# EAGLE schematic dsub37_to_rj45 (EAGLE 7.5.0)
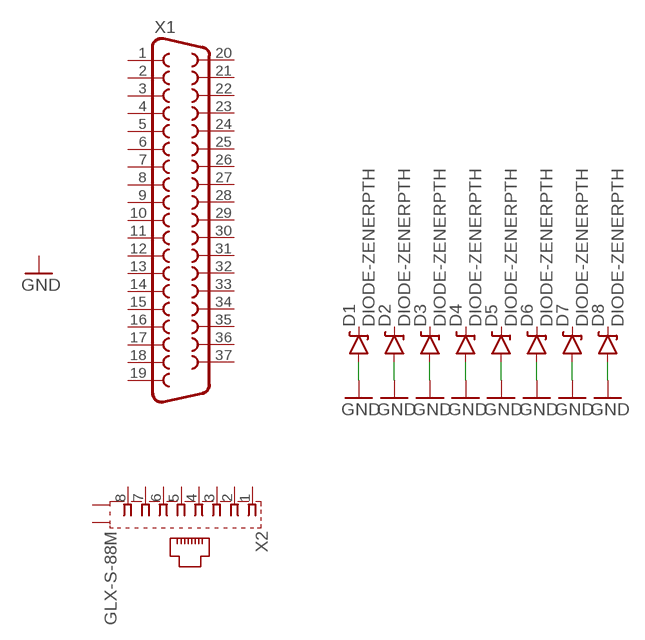
[diagram p0: schematic, sheet 1]

## Parts
D1  DIODE-ZENERPTH  [DIODE-ZENER]
D2  DIODE-ZENERPTH  [DIODE-ZENER]
D3  DIODE-ZENERPTH  [DIODE-ZENER]
D4  DIODE-ZENERPTH  [DIODE-ZENER]
D5  DIODE-ZENERPTH  [DIODE-ZENER]
D6  DIODE-ZENERPTH  [DIODE-ZENER]
D7  DIODE-ZENERPTH  [DIODE-ZENER]
D8  DIODE-ZENERPTH  [DIODE-ZENER]
X1  F37D  [F37D]
X2  GLX-S-88M  [GLX-S-88M]

## Nets
GND: D1.P$2(A) D2.P$2(A) D3.P$2(A) D4.P$2(A) D5.P$2(A) D6.P$2(A) D7.P$2(A) D8.P$2(A)
Unconnected: D1.P$1(C) D2.P$1(C) D3.P$1(C) D4.P$1(C) D5.P$1(C) D6.P$1(C) D7.P$1(C) D8.P$1(C) X1.1 X1.2 X1.3 X1.4 X1.5 X1.6 X1.7 X1.8 X1.9 X1.10 X1.11 X1.12 X1.13 X1.14 X1.15 X1.16 X1.17 X1.18 X1.19 X1.20 X1.21 X1.22 X1.23 X1.24 X1.25 X1.26 X1.27 X1.28 X1.29 X1.30 X1.31 X1.32 X1.33 X1.34 X1.35 X1.36 X1.37 X2.1 X2.2 X2.3 X2.4 X2.5 X2.6 X2.7 X2.8 X2.S1 X2.S2

## Library data of the parts
D1-D8 = SparkFun-DiscreteSemi:DIODE-ZENER: Zener Diode Production Part - 8199 3.4V Zener Voltage
X1 = con-subd:F37: SUB-D; OC_FARNELL: unknown; OC_NEWARK: unknown
X2 = con-kycon:GLX-S-88M: Mod. Jack, Right Angle, 8 posiotion, 8 contatcs RJ45 Source: GLX-S-88M.pdf; OC_FARNELL: unknown; OC_NEWARK: unknown